# EasyEDA schematic 1-Schematic_Universal 3D Printer PDB.json
TITLE: PDB; REV: 1.1; Date: 2021-01-23; Sheet: 1/1; Drawn By: Jacopo Franco; Company: Addittiverse.dev
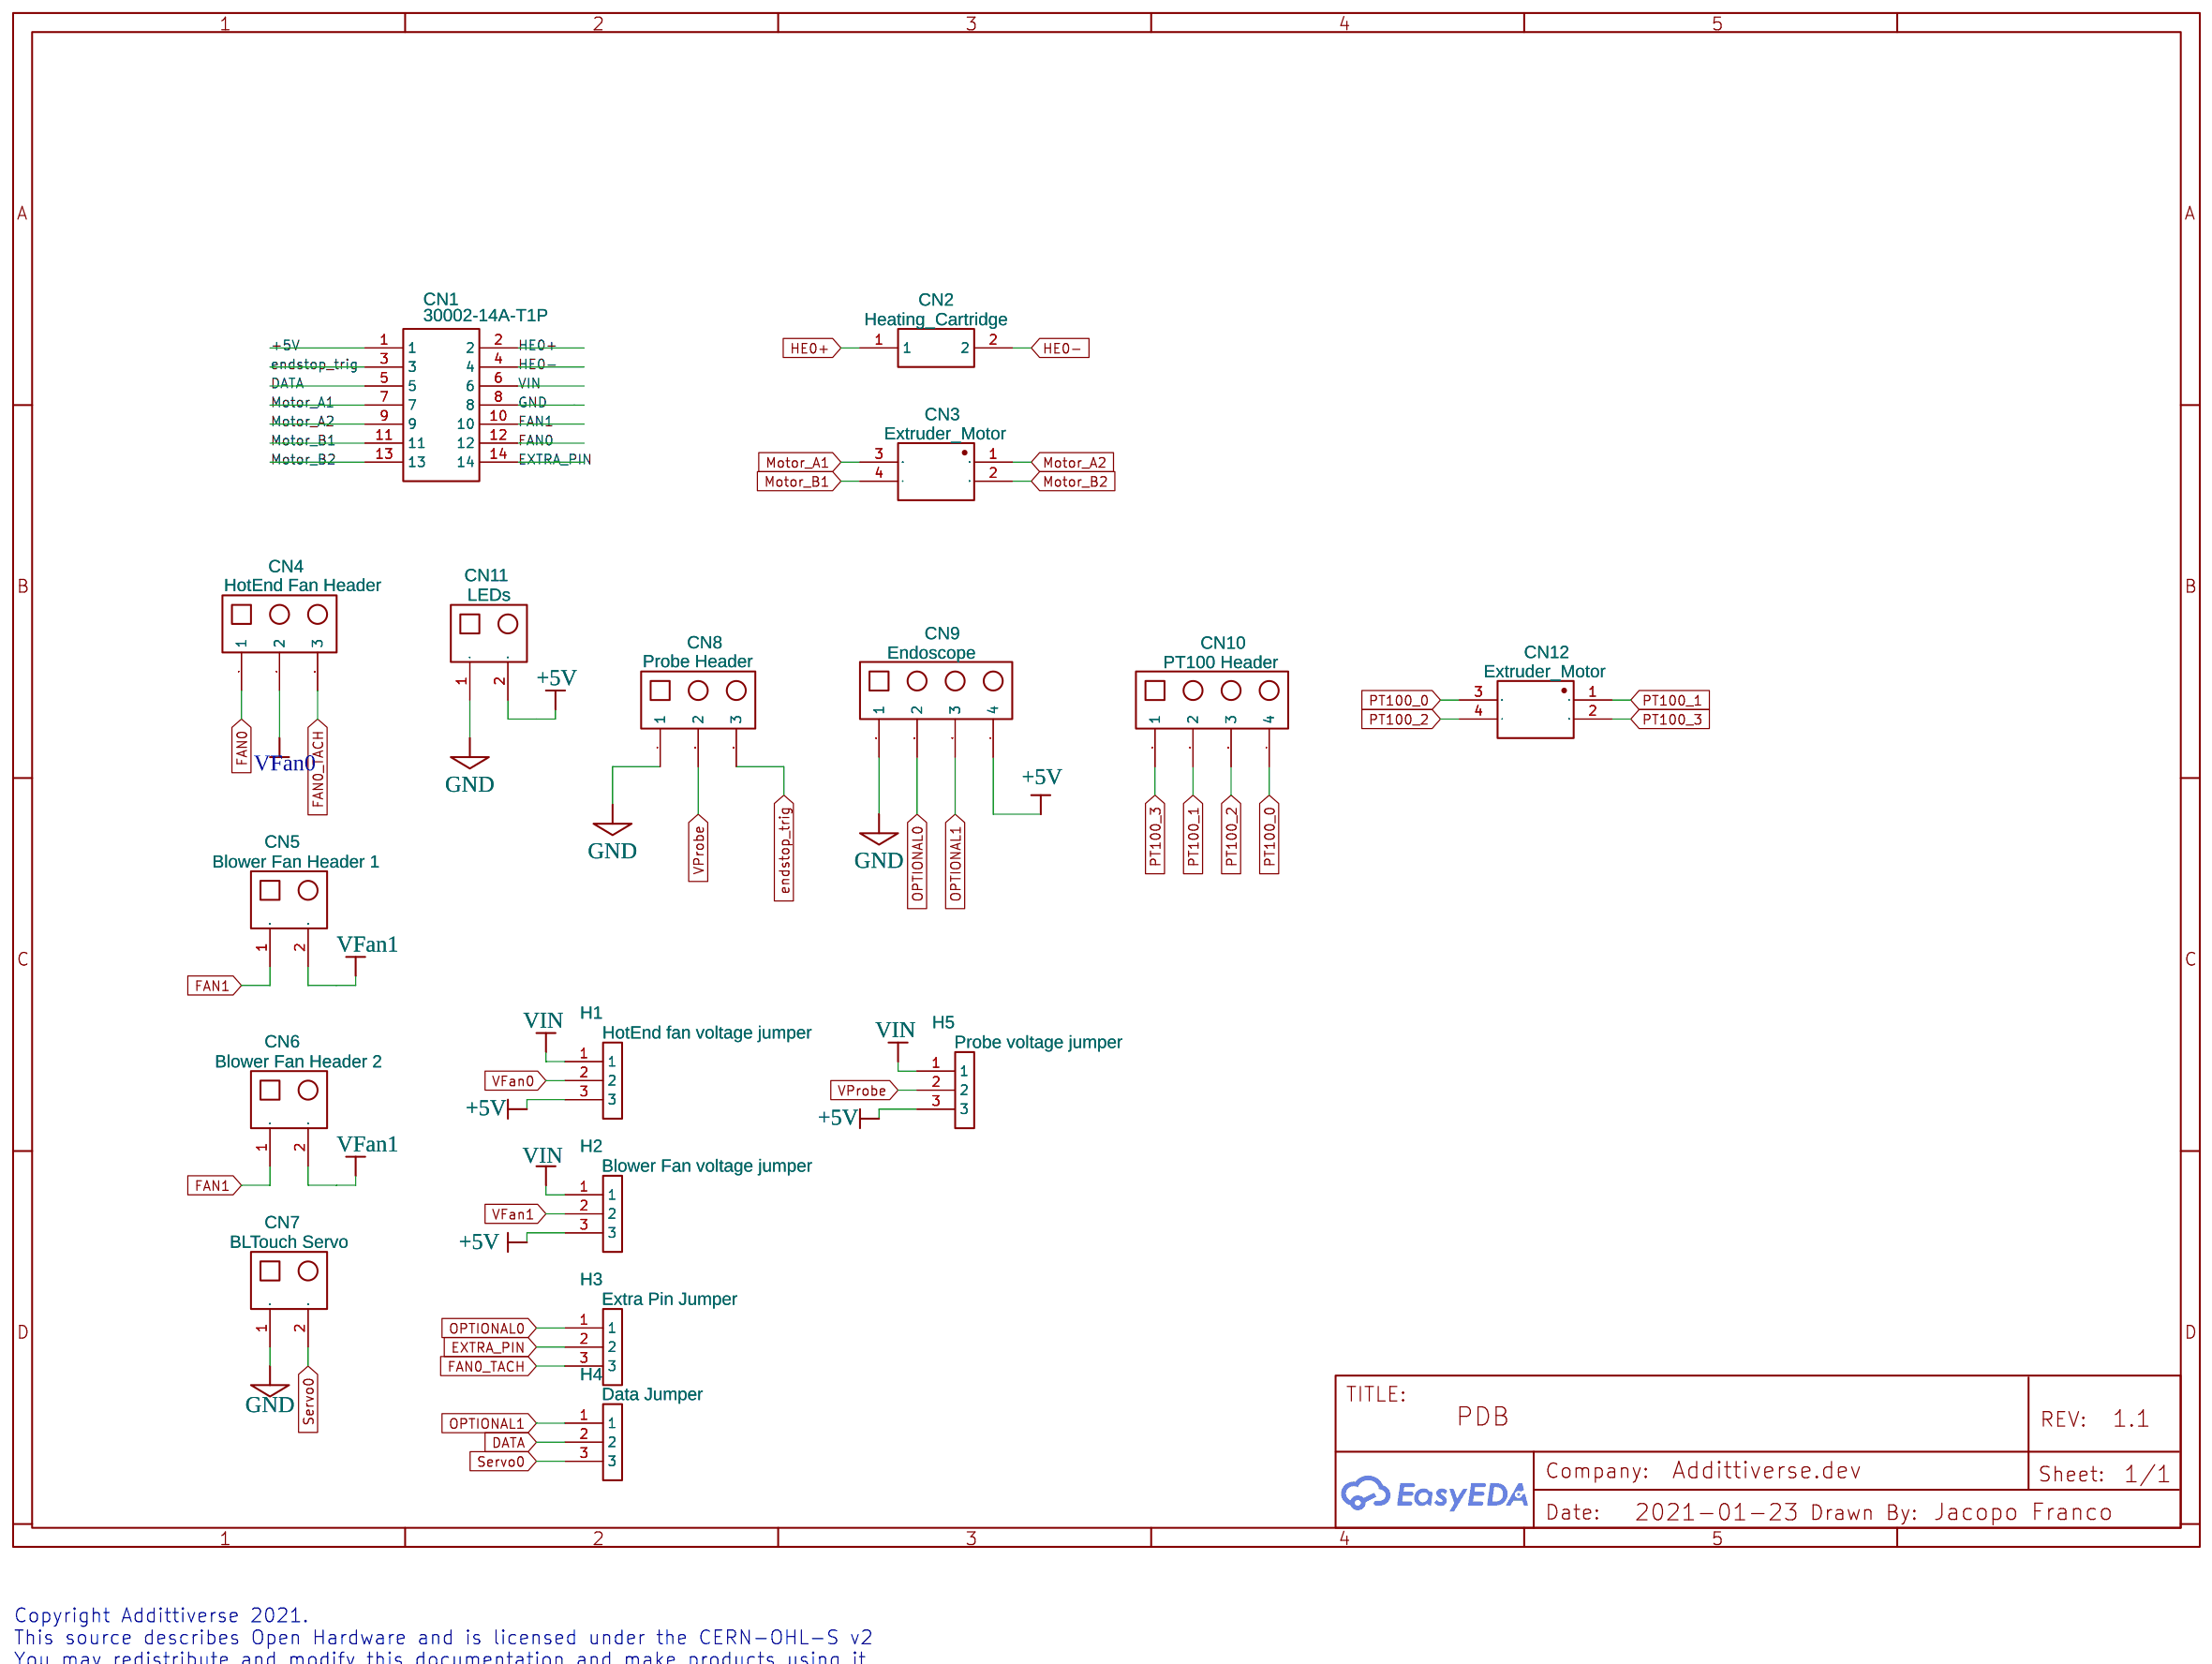
[diagram p0: schematic sheet]

## Parts
CN1  30002-14A-T1P  [CONN-TH_30002-14A-T1P]
CN2  Heating_Cartridge  [CONN-TH_43045-0200]
CN3  Extruder_Motor  [CONN-TH_430450427]
CN4  HotEnd Fan Header  [JST_XH_B03B-XH-A_03X2.50MM_STRAIGHT]
CN5  Blower Fan Header 1  [JST_XH_B02B-XH-A_02X2.50MM_STRAIGHT]
CN6  Blower Fan Header 2  [JST_XH_B02B-XH-A_02X2.50MM_STRAIGHT]
CN7  BLTouch Servo  [JST_XH_B02B-XH-A_02X2.50MM_STRAIGHT]
CN8  Probe Header  [JST_XH_B03B-XH-A_03X2.50MM_STRAIGHT]
CN9  Endoscope  [JST XH-04]
CN10  PT100 Header  [JST XH-04]
CN11  LEDs  [JST_XH_B02B-XH-A_02X2.50MM_STRAIGHT]
CN12  Extruder_Motor  [CONN-TH_430450427]
H1  HotEnd fan voltage jumper  [HEADER 3P STEEK 2.54MM]
H2  Blower Fan voltage jumper  [HEADER 3P STEEK 2.54MM]
H3  Extra Pin Jumper  [HEADER 3P STEEK 2.54MM]
H4  Data Jumper  [HEADER 3P STEEK 2.54MM]
H5  Probe voltage jumper  [HEADER 3P STEEK 2.54MM]

## Library data of the parts
CN1 = 30002-14A-T1P: Supplier: LCSC; Supplier Part: C185094; Manufacturer: Zhejiang Yueqing Hongxing Elec; Contributor: LCSC
CN2 = 0430450200: Supplier: LCSC; Manufacturer: MOLEX; Supplier Part: C122431; LCSC Assembly: Yes; SMT Type: Extend
CN3 CN12 = 430450427: Supplier: LCSC; Supplier Part: C293536; Manufacturer: MOLEX; Contributor: LCSC; LCSC Assembly: Yes; SMT Type: Extend
CN4 CN8 = JST_XH CONNECTOR 3: Manufacturer Part: JST_XH CONNECTOR; link: https://nl.aliexpress.com/item/50-sets-Kit-in-doos-2-p-3-p-4-pin-2-54mm-Pitch-Terminal-Behuizing/32681086028.html?spm=a2g0s.9042311.0.0.I0g15Z; Contributor: j.arts87
CN5-CN7 CN11 = JST XH 2PIN: Manufacturer Part: XH_2P_CONNECTOR; Supplier: AliExpress; Link: https://www.aliexpress.com/item/Kit-2P-3P-4P-5P-6P-7P-8P-9P-10P-11P-12-16-Pin-2-54mm/32829258839.html?spm=a2g0s.9042311.0.0.WgFj6T; Price (USD): 0.05
CN9 CN10 = JST XH-04: Manufacturer Part: JST_XH CONNECTOR; link: https://nl.aliexpress.com/item/50-sets-Kit-in-doos-2-p-3-p-4-pin-2-54mm-Pitch-Terminal-Behuizing/32681086028.html?spm=a2g0s.9042311.0.0.I0g15Z; Contributor: j.arts87
H1-H5 = Header 3P 2.54mm: Contributor: fslomp

## Nets
+5V: CN1.1 CN9.4 CN11.2 H1.3 H2.3 H5.3
GND: CN1.8 CN7.1 CN8.1 CN9.1 CN11.1
VIN: CN1.6 H1.1 H2.1 H5.1
DATA: CN1.5 H4.2
endstop_trig: CN1.3 CN8.3
EXTRA_PIN: CN1.14 H3.2
FAN0: CN1.12 CN4.1
FAN0_TACH: CN4.3 H3.3
FAN1: CN1.10 CN5.1 CN6.1
HE0+: CN1.2 CN2.1
HE0-: CN1.4 CN2.2
Motor_A1: CN1.7 CN3.3
Motor_A2: CN1.9 CN3.1
Motor_B1: CN1.11 CN3.4
Motor_B2: CN1.13 CN3.2
OPTIONAL0: CN9.2 H3.1
OPTIONAL1: CN9.3 H4.1
PT100_0: CN10.4 CN12.3
PT100_1: CN10.2 CN12.1
PT100_2: CN10.3 CN12.4
PT100_3: CN10.1 CN12.2
Servo0: CN7.2 H4.3
VFan0: CN4.2 H1.2
VFan1: CN5.2 CN6.2 H2.2
VProbe: CN8.2 H5.2

## Notes on the sheet
- Copyright Addittiverse 2021.
  This source describes Open Hardware and is licensed under the CERN-OHL-S v2
  You may redistribute and modify this documentation and make products using it
  under the terms of the CERN-OHL-S v2 (https:/cern.ch/cern-ohl).
  This documentation is distributed WITHOUT ANY EXPRESS OR IMPLIED WARRANTY, INCLUDING OF MERCHANTABILITY, SATISFACTORY QUALITY AND FITNESS FOR A PARTICULAR PURPOSE.
  Please see the CERN-OHL-S v2 for applicable conditions.
  Source location: https://github.com/Blaster1920/Universal-3D-Printer-PDB
  As per CERN-OHL-S v2 section 4, should You produce hardware based on these sources,
  You must maintain the Source Location visible on the PCB of the Universal-3D-Printer-PDB or other product you make using this documentation.
